# Altium schematic sheet Board-IOExpander.SchDoc: =ProjectTitle
size 297 x 209 mm; Address1: Address1; Address2: Address2; Address3: Address3; Address4: Address4; SheetNumber: ?; SheetTotal: ?; Scale: 1:1; DocumentType: Схема электрическая принципиальная
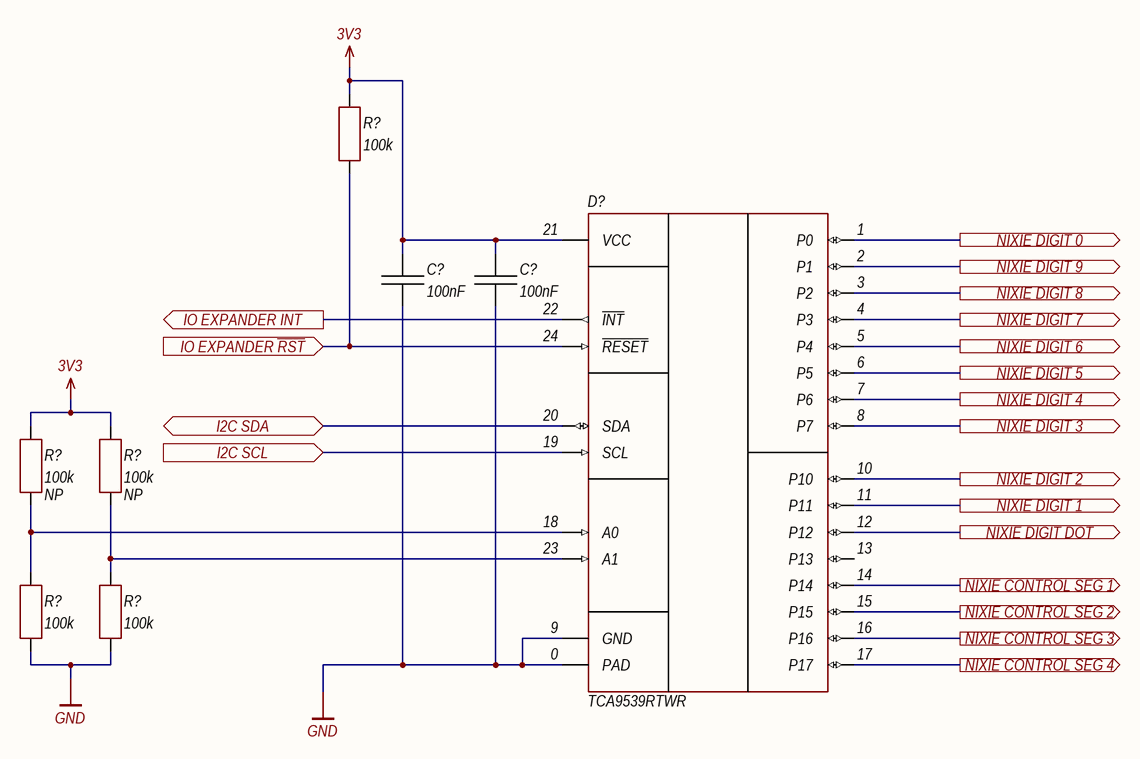
[diagram p0: Board-IOExpander.SchDoc]

## Parts
(Parts that share a designator on the sheet are numbered #1, #2 ... from top to bottom, then left to right.)
C?#1  100nF  [CH0402C]
C?#2  100nF  [CH0402C]
D?  TCA9539RTWR  [24-QFN (4x4)]
R?#1  100k  [CH0402R]
R?#2  100k  [CH0402R]
R?#3  100k  [CH0402R]
R?#4  100k  [CH0402R]
R?#5  100k  [CH0402R]

## Ports
I2C SCL (in), I2C SDA (bidir), IO EXPANDER INT (out), IO EXPANDER ~{RST} (in), NIXIE CONTROL SEG 1 (out), NIXIE CONTROL SEG 2 (out), NIXIE CONTROL SEG 3 (out), NIXIE CONTROL SEG 4 (out), NIXIE DIGIT 0 (out), NIXIE DIGIT 1 (out), NIXIE DIGIT 2 (out), NIXIE DIGIT 3 (out), NIXIE DIGIT 4 (out), NIXIE DIGIT 5 (out), NIXIE DIGIT 6 (out), NIXIE DIGIT 7 (out), NIXIE DIGIT 8 (out), NIXIE DIGIT 9 (out), NIXIE DIGIT DOT (out)

## Nets
3V3: C?#1.2 C?#2.2 D?.21(VCC) R?#1.2 R?#2.2 R?#3.2
GND: C?#1.1 C?#2.1 D?.0(PAD) D?.9(GND) R?#4.1 R?#5.1
I2C SCL: D?.19(SCL) ; port I2C SCL
I2C SDA: D?.20(SDA) ; port I2C SDA
IO EXPANDER INT: D?.22(~{INT}) ; port IO EXPANDER INT
IO EXPANDER ~{RST}: D?.24(~{RESET}) R?#1.1 ; port IO EXPANDER ~{RST}
NIXIE CONTROL SEG 1: D?.14(P14) ; port NIXIE CONTROL SEG 1
NIXIE CONTROL SEG 2: D?.15(P15) ; port NIXIE CONTROL SEG 2
NIXIE CONTROL SEG 3: D?.16(P16) ; port NIXIE CONTROL SEG 3
NIXIE CONTROL SEG 4: D?.17(P17) ; port NIXIE CONTROL SEG 4
NIXIE DIGIT 0: D?.1(P0) ; port NIXIE DIGIT 0
NIXIE DIGIT 1: D?.11(P11) ; port NIXIE DIGIT 1
NIXIE DIGIT 2: D?.10(P10) ; port NIXIE DIGIT 2
NIXIE DIGIT 3: D?.8(P7) ; port NIXIE DIGIT 3
NIXIE DIGIT 4: D?.7(P6) ; port NIXIE DIGIT 4
NIXIE DIGIT 5: D?.6(P5) ; port NIXIE DIGIT 5
NIXIE DIGIT 6: D?.5(P4) ; port NIXIE DIGIT 6
NIXIE DIGIT 7: D?.4(P3) ; port NIXIE DIGIT 7
NIXIE DIGIT 8: D?.3(P2) ; port NIXIE DIGIT 8
NIXIE DIGIT 9: D?.2(P1) ; port NIXIE DIGIT 9
NIXIE DIGIT DOT: D?.12(P12) ; port NIXIE DIGIT DOT
NetD?_18: D?.18(A0) R?#2.1 R?#4.2
NetD?_23: D?.23(A1) R?#3.1 R?#5.2

Not connected (* = marked no-connect by the designer): D? 13(P13)

## Notes on the sheet
- Изм.
- Лист
- № докум.
- Подп.
- Дата
- Копировал
- Формат А4

## Library data of the parts
C?#1 C?#2 = Capacitor: Manufacturer: CCTC; Model: TCC0402X7R104K250AT; HelpURL: https://lcsc.com/product-detail/Multilayer-Ceramic-Capacitors-MLCC-SMD-SMT_CCTC-TCC0402X7R104K250AT_C466234.html; ComponentKind: X7R, 50V; Value: 100nF
D? = TCA9539: 16-bit I2C IO expander; Manufacturer: Texas Instruments; Model: TCA9539RTWR; HelpURL: https://lcsc.com/product-detail/Interface-I-O-Expanders_Texas-Instruments_TCA9539RTWR_Texas-Instruments-Texas-Instruments-TCA9539RTWR_C134039.html; ComponentKind: 1.65-5.5V, 400kHz
R?#1-R?#5 = Resistor: Manufacturer: Uniroyal Elec; Model: 0402WGF1003TCE; HelpURL: https://lcsc.com/product-detail/Chip-Resistor-Surface-Mount_UNI-ROYAL-Uniroyal-Elec-0402WGF1003TCE_C25741.html; ComponentKind: ±1%; Value: 100k
  R?#2 R?#3: NP: NP